# EAGLE design M-Toggle (EAGLE 7.6.0)
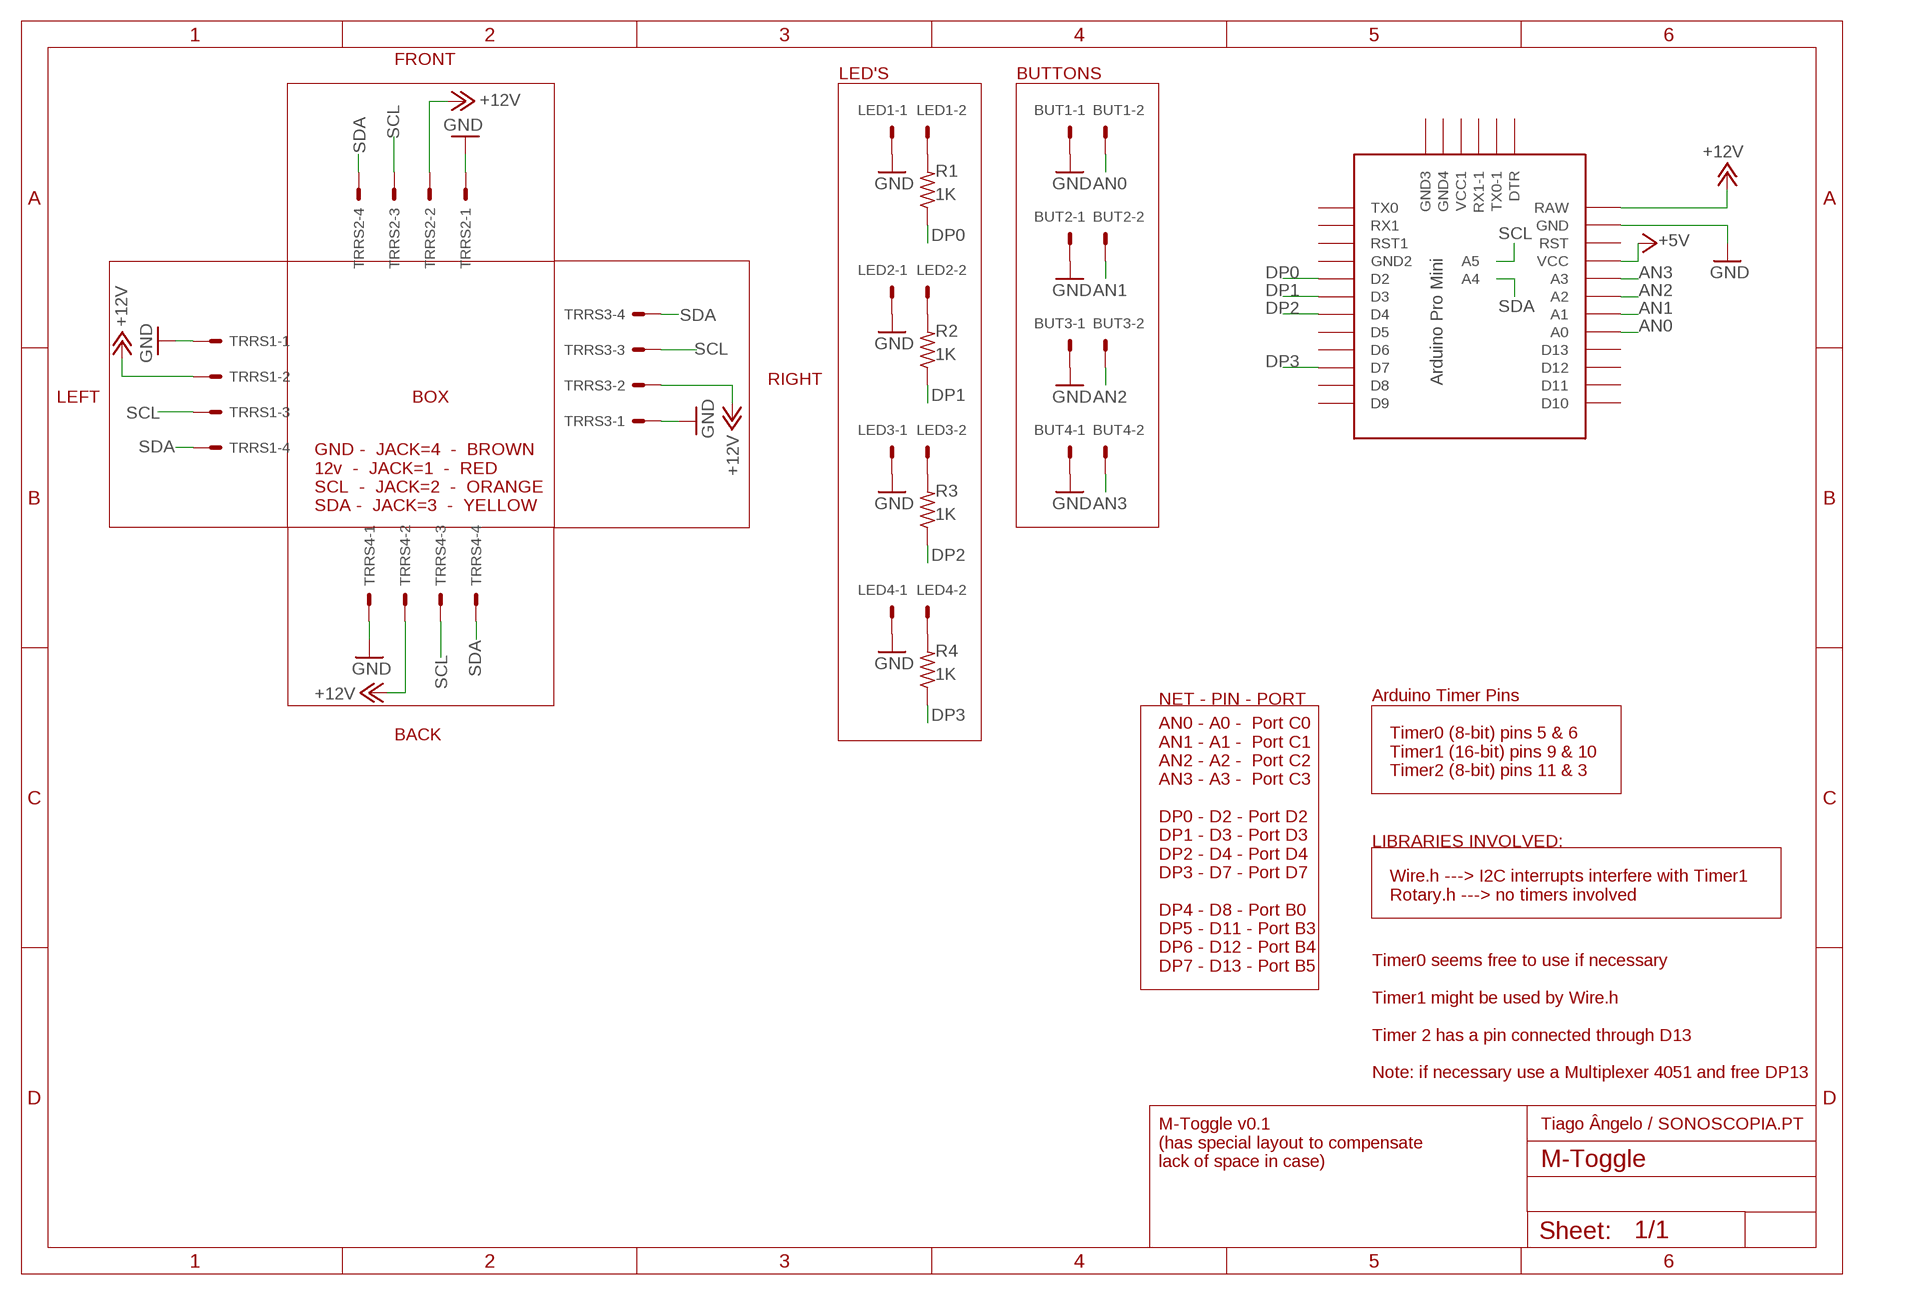
[diagram p0: schematic, sheet 1]

## Parts
BUT1  22-27-2021-02  [6410-02]
BUT2  22-27-2021-02  [6410-02]
BUT3  22-27-2021-02  [6410-02]
BUT4  22-27-2021-02  [6410-02]
LED1  22-27-2021-02  [6410-02]
LED2  22-27-2021-02  [6410-02]
LED3  22-27-2021-02  [6410-02]
LED4  22-27-2021-02  [6410-02]
R1  1K  R-US_0204/7  [0204/7]
R2  1K  R-US_0204/7  [0204/7]
R3  1K  R-US_0204/7  [0204/7]
R4  1K  R-US_0204/7  [0204/7]
TRRS1  22-27-2041-04  [6410-04]
TRRS2  22-27-2041-04  [6410-04]
TRRS3  22-27-2041-04  [6410-04]
TRRS4  22-27-2041-04  [6410-04]
U$1  PRO-MINI-2  [PRO-MINI-2]

## Nets
+5V: U$1.VCC
+12V: TRRS1.2 TRRS2.2 TRRS3.2 TRRS4.2 U$1.RAW
AN0: BUT1.2 U$1.A0
AN1: BUT2.2 U$1.A1
AN2: BUT3.2 U$1.A2
AN3: BUT4.2 U$1.A3
DP0: R1.1 U$1.D2
DP1: R2.1 U$1.D3
DP2: R3.1 U$1.D4
DP3: R4.1 U$1.D7
GND: BUT1.1 BUT2.1 BUT3.1 BUT4.1 LED1.1 LED2.1 LED3.1 LED4.1 TRRS1.1 TRRS2.1 TRRS3.1 TRRS4.1 U$1.GND
N$1: LED1.2 R1.2
N$2: LED2.2 R2.2
N$3: LED3.2 R3.2
N$4: LED4.2 R4.2
SCL: TRRS1.3 TRRS2.3 TRRS3.3 TRRS4.3 U$1.A5
SDA: TRRS1.4 TRRS2.4 TRRS3.4 TRRS4.4 U$1.A4
Unconnected: U$1.D5 U$1.D6 U$1.D8 U$1.D9 U$1.D10 U$1.D11 U$1.D12 U$1.D13 U$1.DTR U$1.GND1(GND2) U$1.GND2(GND3) U$1.GND3(GND4) U$1.RST U$1.RST1 U$1.RX1 U$1.RX1-1 U$1.TX0 U$1.TX0-1 U$1.VCC1

## Notes on the sheet
- FRONT
- LED'S | BUTTONS
- RIGHT
- LEFT | BOX
- GND -  JACK=4  -  BROWN
  12v  -  JACK=1  -  RED
  SCL  -  JACK=2  -  ORANGE
  SDA -  JACK=3  -  YELLOW
- NET - PIN - PORT | Arduino Timer Pins
- BACK
- Timer0 (8-bit) pins 5 & 6
  Timer1 (16-bit) pins 9 & 10 
  Timer2 (8-bit) pins 11 & 3
- LIBRARIES INVOLVED:
- Wire.h ---> I2C interrupts interfere with Timer1
  Rotary.h ---> no timers involved
- AN0 - A0 -  Port C0
  AN1 - A1 -  Port C1
  AN2 - A2 -  Port C2
  AN3 - A3 -  Port C3 
  
  DP0 - D2 - Port D2
  DP1 - D3 - Port D3
  DP2 - D4 - Port D4
  DP3 - D7 - Port D7
  
  DP4 - D8 - Port B0
  DP5 - D11 - Port B3
  DP6 - D12 - Port B4
  DP7 - D13 - Port B5
- Timer0 seems free to use if necessary 
  
  Timer1 might be used by Wire.h
  
  Timer 2 has a pin connected through D13
  
  Note: if necessary use a Multiplexer 4051 and free DP13
- Tiago Ângelo / SONOSCOPIA.PT
- M-Toggle v0.1
  (has special layout to compensate 
  lack of space in case)

## Library data of the parts
BUT1-BUT4 LED1-LED4 = _M-BLOCKS:22-?-02: CONNECTOR wire to board 2.54 mm (.1 inch) pitch header
R1-R4 = adafruit:R-US_: RESISTOR, American symbol
TRRS1-TRRS4 = _M-BLOCKS:22-?-04: CONNECTOR wire to board 2.54 mm (.1 inch) pitch header
U$1 = _M-BLOCKS:PRO-MINI-2: Arduino Pro Mini Layout 2 Sparkfun.com

## Board
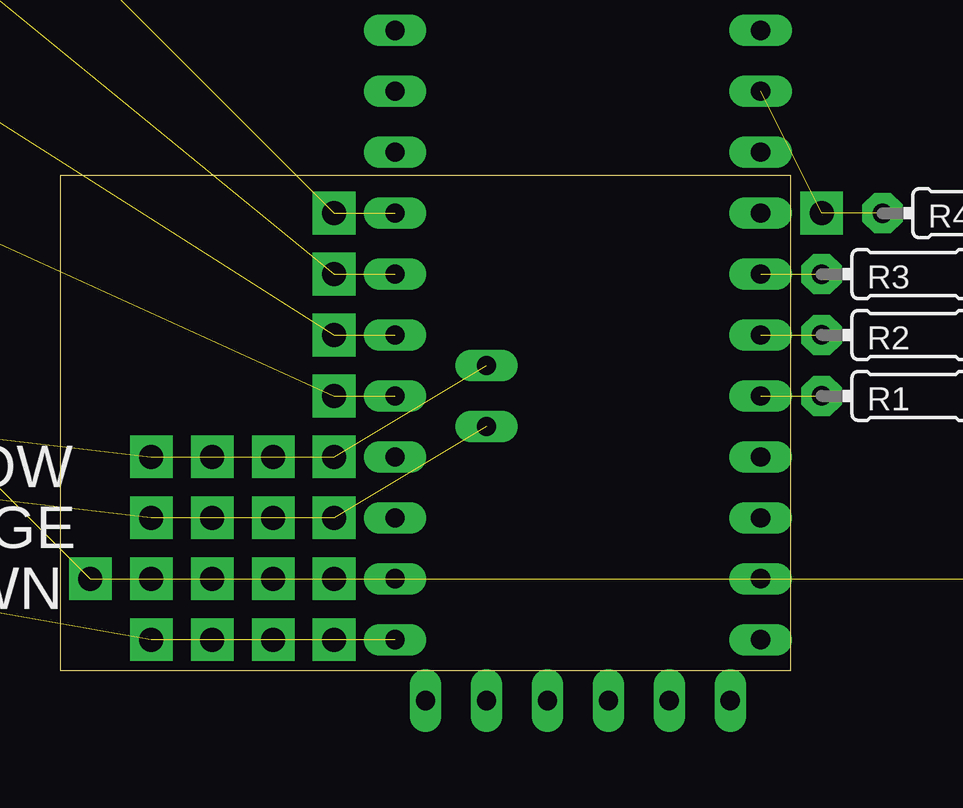
[diagram p1: board, top side]

Size 30.46 x 20.62 mm. Coordinates in mm from the lower left corner, seen from the top.
Outline: 0,0 30.46,0 30.46,20.62 0,20.62 0,0
Copper layers (1*16): Top 0.035mm / dielectric 1.5mm / Bottom 0.035mm
Design rules "default": minimum track width 10mil, minimum drill 24mil, track to track 8mil, track to pad 8mil, pad to pad 8mil, via to via 8mil, smd to smd 8mil, copper to edge 40mil, drill to drill 8mil, minimum pad ring 10mil, minimum via ring 8mil, stop-mask expansion 4mil, vias tented up to drill 0mil, thermal gap 10mil

### Footprints (pad centres in the part's own frame; a part is rotated, then mirrored left to right if it is on the bottom)
6410-02 = drill 1.016 long: 1 1.27,0; 2 -1.27,0
0204/7 = drill 0.813 pad 1.676 octagon: 1 -3.81,0; 2 3.81,0
6410-04 = drill 1.016 long: 1 3.81,0; 2 1.27,0; 3 -1.27,0; 4 -3.81,0
PRO-MINI-2 = drill 0.8 long: A0 6.35,-5.08; A1 6.35,-2.54; A2 6.35,0; A3 6.35,2.54; A4 2.54,1.27; A5 2.54,3.81; D2 -8.89,2.54; D3 -8.89,0; D4 -8.89,-2.54; D5 -8.89,-5.08; D6 -8.89,-7.62; D7 -8.89,-10.16; D8 -8.89,-12.7; D9 -8.89,-15.24; D10 6.35,-15.24; D11 6.35,-12.7; D12 6.35,-10.16; D13 6.35,-7.62; DTR 5.08,15.24; GND 6.35,10.16; GND1 -8.89,5.08; GND2 -7.62,15.24; GND3 -5.08,15.24; RAW 6.35,12.7; RST 6.35,7.62; RST1 -8.89,7.62; RX1 -8.89,10.16; RX1-1 0,15.24; TX0 -8.89,12.7; TX0-1 2.54,15.24; VCC 6.35,5.08; VCC1 -2.54,15.24

### Placement (x,y rotation side)
BUT1  -17.78,46.99 180 top  (outside the outline)
BUT2  -17.78,39.37 180 top  (outside the outline)
BUT3  -17.78,31.75 180 top  (outside the outline)
BUT4  -17.78,24.13 180 top  (outside the outline)
LED1  59.69,5.08 270 top  (outside the outline)
LED2  59.69,12.7 270 top  (outside the outline)
LED3  59.69,20.32 270 top  (outside the outline)
LED4  59.69,27.94 270 top  (outside the outline)
R1  35.56,11.43 0 top
R2  35.56,13.97 0 top
R3  35.56,16.51 0 top
R4  38.1,19.05 0 top  (outside the outline)
TRRS1  -62.23,10.16 270 top  (outside the outline)
TRRS2  -54.61,10.16 270 top  (outside the outline)
TRRS3  -46.99,10.16 270 top  (outside the outline)
TRRS4  -39.37,10.16 270 top  (outside the outline)
U$1  20.32,13.97 180 top

### Tracks (layer width: path | path; a pad name or v marks a point on that pad's centre or on a via)
+12V  (via drill 1 pad 1.78)  (8 unrouted)
  other vias: 11.43,1.27 8.89,1.27 6.35,1.27 3.81,1.27
AN0  (via drill 1 pad 1.78)  (2 unrouted)
  other vias: 11.43,19.05
AN1  (via drill 1 pad 1.78)  (2 unrouted)
  other vias: 11.43,16.51
AN2  (via drill 1 pad 1.78)  (2 unrouted)
  other vias: 11.43,13.97
AN3  (via drill 1 pad 1.78)  (2 unrouted)
  other vias: 11.43,11.43
DP0  (1 unrouted)
DP1  (1 unrouted)
DP2  (1 unrouted)
DP3  (via drill 1 pad 1.78)  (2 unrouted)
  other vias: 31.75,19.05
GND  (via drill 1 pad 1.78)  (17 unrouted)
  other vias: 11.43,3.81 8.89,3.81 6.35,3.81 3.81,3.81 1.27,3.81
N$1  (via drill 1 pad 1.78)  (2 unrouted)
  other vias: 41.91,11.43
N$2  (via drill 1 pad 1.78)  (2 unrouted)
  other vias: 41.91,13.97
N$3  (via drill 1 pad 1.78)  (2 unrouted)
  other vias: 41.91,16.51
N$4  (via drill 1 pad 1.78)  (2 unrouted)
  other vias: 44.45,19.05
SCL  (via drill 1 pad 1.78)  (8 unrouted)
  other vias: 3.81,6.35 6.35,6.35 8.89,6.35 11.43,6.35
SDA  (via drill 1 pad 1.78)  (8 unrouted)
  other vias: 3.81,8.89 6.35,8.89 8.89,8.89 11.43,8.89

### Text on the board
tNames: SDA(3) - YELLOW | SCL(2) - ORANGE | GND(4) - BROWN | +12V(1) - RED